# Altium schematic sheet DWM1000Breakout.SchDoc: DecaWave DWM1000
size A4; CompanyName: SPAN; Engineer: Anh Luong; Organization: University of Utah; Address1: 50 S Central Campus Dr; Address2: MEB Rm 3129; Address3: Salt Lake City, Utah 84115; Address4: USA; Revision: 1; SheetNumber: 1; SheetTotal: 1
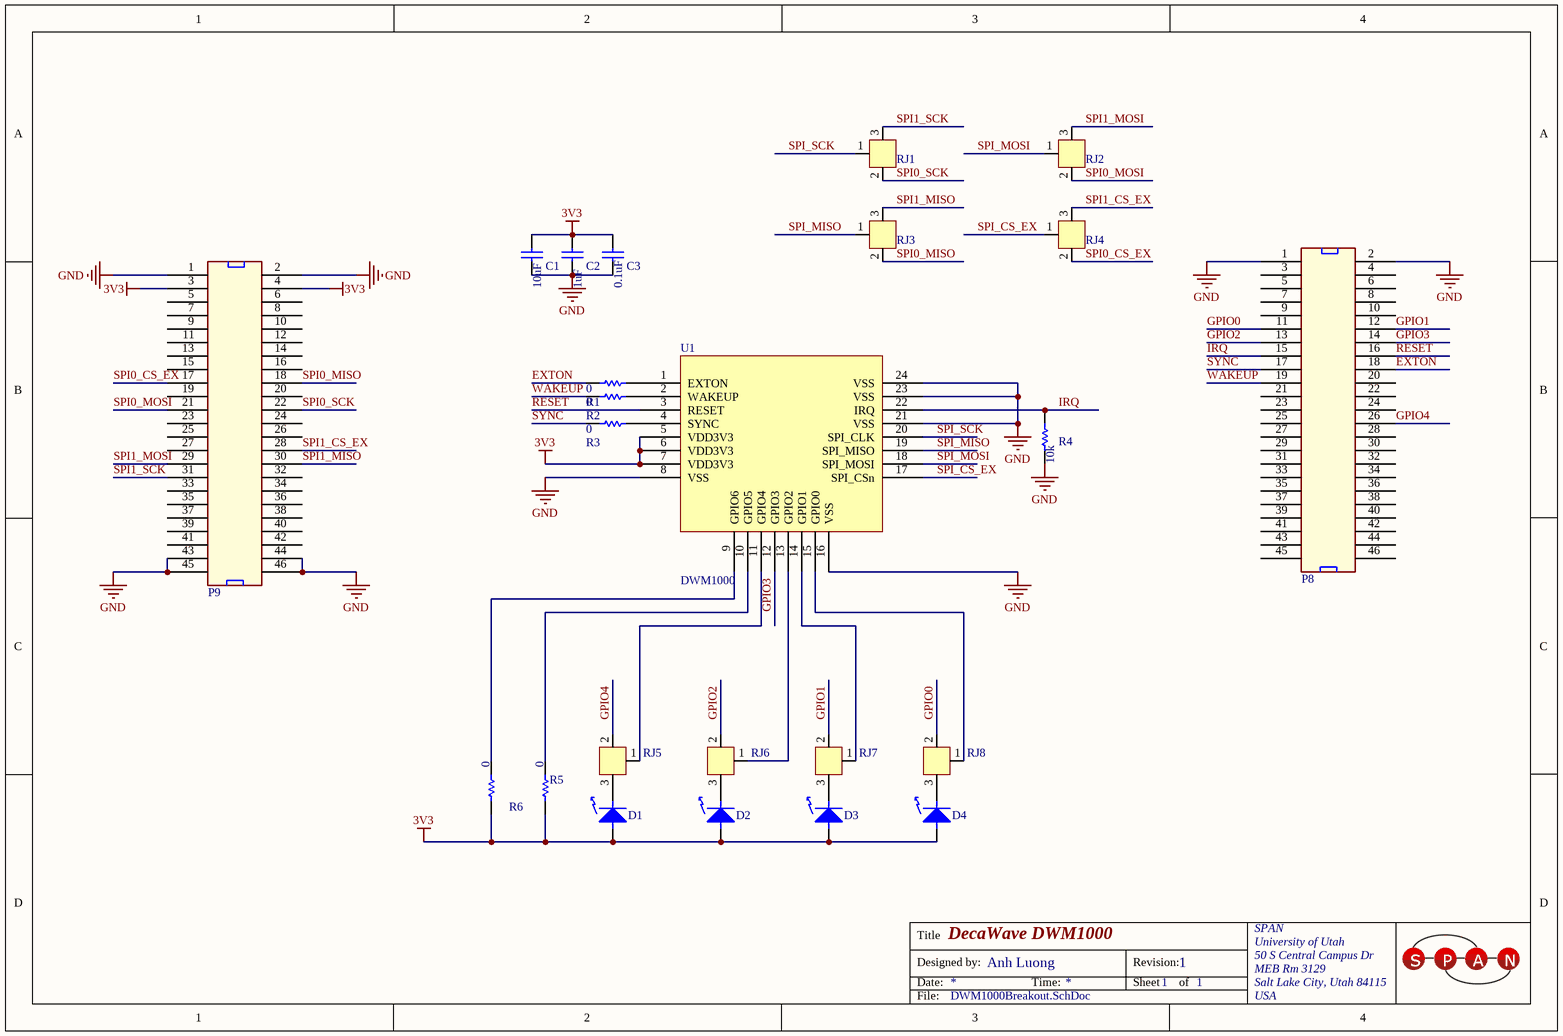
[diagram p0: DWM1000Breakout.SchDoc]

## Parts
C1  GRM188R60J106ME47D  [CAPC1608X08N (0603)]  (value not drawn)
C2  GRM188R61A105KA61D  [CAPC1608X08N (0603)]  (value not drawn)
C3  GRM188R71C104KA01D  [CAPC1608X08N (0603)]  (value not drawn)
D1  LG Q971-KN-1  [CHIPLED0603]  (value not drawn)
D2  LG Q971-KN-1  [CHIPLED0603]  (value not drawn)
D3  LG Q971-KN-1  [CHIPLED0603]  (value not drawn)
D4  LG Q971-KN-1  [CHIPLED0603]  (value not drawn)
P8  PREC023DAAN-RC  [HEADER23X2]  (value not drawn)
P9  PREC023DAAN-RC  [HEADER23X2]  (value not drawn)
R1  MCR03ERTJ000  [RESC1608X06N (0603)]  (value not drawn)
R2  MCR03ERTJ000  [RESC1608X06N (0603)]  (value not drawn)
R3  MCR03ERTJ000  [RESC1608X06N (0603)]  (value not drawn)
R4  MCR03ERTJ103  [RESC1608X06N (0603)]  (value not drawn)
R5  MCR03ERTJ000  [RESC1608X06N (0603)]  (value not drawn)
R6  MCR03ERTJ000  [RESC1608X06N (0603)]  (value not drawn)
RJ1  R_J  [RJ]  (value not drawn)
RJ2  R_J  [RJ]  (value not drawn)
RJ3  R_J  [RJ]  (value not drawn)
RJ4  R_J  [RJ]  (value not drawn)
RJ5  R_J  [RJ]  (value not drawn)
RJ6  R_J  [RJ]  (value not drawn)
RJ7  R_J  [RJ]  (value not drawn)
RJ8  R_J  [RJ]  (value not drawn)
U1  DWM1000  [DWM1000]

## Nets
3V3: C1.2 C2.2 C3.2 D1.1 D2.1 D3.1 D4.1 P9.3 P9.4 R5.2 R6.2 U1.5(VDD3V3) U1.6(VDD3V3) U1.7(VDD3V3)
GND: C1.1 C2.1 C3.1 P8.1 P8.2 P9.1 P9.2 P9.43 P9.44 P9.45 P9.46 R4.1 U1.8(VSS) U1.16(VSS) U1.21(VSS) U1.23(VSS) U1.24(VSS)
EXTON: P8.18 R1.1
GPIO0: P8.11 RJ8.2
GPIO1: P8.12 RJ7.2
GPIO2: P8.13 RJ6.2
GPIO3: P8.14 U1.12(GPIO3)
GPIO4: P8.26 RJ5.2
IRQ: P8.15 R4.2 U1.22(IRQ)
RESET: P8.16 U1.3(RESET)
SPI0_CS_EX: P9.17 RJ4.2
SPI0_MISO: P9.18 RJ3.2
SPI0_MOSI: P9.21 RJ2.2
SPI0_SCK: P9.22 RJ1.2
SPI1_CS_EX: P9.28 RJ4.3
SPI1_MISO: P9.30 RJ3.3
SPI1_MOSI: P9.29 RJ2.3
SPI1_SCK: P9.31 RJ1.3
SPI_CS_EX: RJ4.1 U1.17(SPI_CSn)
SPI_MISO: RJ3.1 U1.19(SPI_MISO)
SPI_MOSI: RJ2.1 U1.18(SPI_MOSI)
SPI_SCK: RJ1.1 U1.20(SPI_CLK)
SYNC: P8.17 R3.1
WAKEUP: P8.19 R2.1
NetD1_2: D1.2 RJ5.3
NetD2_2: D2.2 RJ6.3
NetD3_2: D3.2 RJ7.3
NetD4_2: D4.2 RJ8.3
NetR1_2: R1.2 U1.1(EXTON)
NetR2_2: R2.2 U1.2(WAKEUP)
NetR3_2: R3.2 U1.4(SYNC)
NetR5_1: R5.1 U1.10(GPIO5)
NetR6_1: R6.1 U1.9(GPIO6)
NetRJ5_1: RJ5.1 U1.11(GPIO4)
NetRJ6_1: RJ6.1 U1.13(GPIO2)
NetRJ7_1: RJ7.1 U1.14(GPIO1)
NetRJ8_1: RJ8.1 U1.15(GPIO0)

Not connected (* = marked no-connect by the designer): P8 3(2) 4(27) 5(3) 6(28) 7(4) 8(29) 9(5) 10(30) 20(35) 21(11) 22(36) 23(12) 24(37) 25(13) 27(14) 28(39) 29(15) 30(40) 31(16) 32(41) 33(17) 34(42) 35(18) 36(43) 37(19) 38(44) 39(20) 40(45) 41(21) 42(46) 43(22) 44(47) 45(23) 46(48); P9 5(3) 6(28) 7(4) 8(29) 9(5) 10(30) 11(6) 12(31) 13(7) 14(32) 15(8) 16(33) 19(10) 20(35) 23(12) 24(37) 25(13) 26(38) 27(14) 32(41) 33(17) 34(42) 35(18) 36(43) 37(19) 38(44) 39(20) 40(45) 41(21) 42(46)

## Notes on the sheet
- Title
- Designed by:
- Date:
- Time:
- Revision:
- Sheet
- of
- File:
- (in symbol GRM188R60J106ME47D) 10uF
- (in symbol GRM188R61A105KA61D) 1uF
- (in symbol GRM188R71C104KA01D) 0.1uF
- (in symbol MCR03ERTJ000) 0

## Library data of the parts
C1 = GRM188R60J106ME47D: CAP CER 10UF 6.3V 20% X5R 0603; Manufacturer: Murata Electronics North America; Capacitance: 10µF; Supplier 1: Digi-Key; Manufacturer Part Number: GRM188R60J106ME47D; RoHS: RoHS Compliant; Category: Capacitors; Stock 1: 2128324; Pricing 1: 1=0.24, 10=0.2, 50=0.1126, 100=0.1, 250=0.075, 500=0.06626, 1000=0.05875 (USD); Packaging: Digi-Reel®; Voltage - Rated: 6.3V; Tolerance: ±20%; Temperature Coefficient: X5R; Mounting Type: Surface Mount, MLCC; Operating Temperature: -55°C ~ 85°C; Applications: General Purpose; Ratings: -; Package / Case: 0603 (1608 Metric); Size / Dimension: 0.063" L x 0.031" W (1.60mm x 0.80mm); Height - Seated (Max): -; Thickness (Max): 0.035" (0.90mm); Lead Spacing: -; Features: -; Lead Style: -; ComponentLink1URL: http://search.murata.co.jp/Ceramy/image/img/A01X/G101/ENG/GRM188R60J106ME47-01.pdf; ComponentLink1Description: http://search.murata.co.jp/Ceramy/image/img/A01X/G101/ENG/GRM188R60J106ME47-01.pdf; Supplier 2: Digi-Key
C2 = GRM188R61A105KA61D: CAP CER 1UF 10V 10% X5R 0603; Manufacturer: Murata Electronics North America; Capacitance: 1.0µF; Supplier 1: Digi-Key; Manufacturer Part Number: GRM188R61A105KA61D; RoHS: RoHS Compliant; Category: Capacitors; Stock 1: 244919; Pricing 1: 1=0.1, 10=0.041, 50=0.0224, 100=0.019, 250=0.01552, 500=0.01328, 1000=0.01035 (USD); Packaging: Cut Tape (CT); Voltage - Rated: 10V; Tolerance: ±10%; Temperature Coefficient: X5R; Mounting Type: Surface Mount, MLCC; Operating Temperature: -55°C ~ 85°C; Applications: General Purpose; Ratings: -; Package / Case: 0603 (1608 Metric); Size / Dimension: 0.063" L x 0.031" W (1.60mm x 0.80mm); Height - Seated (Max): -; Thickness (Max): 0.035" (0.90mm); Lead Spacing: -; Features: -; Lead Style: -; ComponentLink1URL: http://search.murata.co.jp/Ceramy/image/img/A01X/G101/ENG/GRM188R61A105KA61-01.pdf; ComponentLink1Description: http://search.murata.co.jp/Ceramy/image/img/A01X/G101/ENG/GRM188R61A105KA61-01.pdf
C3 = GRM188R71C104KA01D: CAP CER 0.1UF 16V 10% X7R 0603; Manufacturer: Murata Electronics North America; Capacitance: 0.1µF; Supplier 1: Digi-Key; Manufacturer Part Number: GRM188R71C104KA01D; RoHS: RoHS Compliant; Category: Capacitors; Stock 1: 1458181; Pricing 1: 1=0.1, 10=0.019, 50=0.0102, 100=0.0086, 250=0.00704, 500=0.006, 1000=0.00468 (USD); Packaging: Cut Tape (CT); Tolerance: ±10%; Voltage - Rated: 16V; Temperature Coefficient: X7R; Mounting Type: Surface Mount, MLCC; Operating Temperature: -55°C ~ 125°C; Applications: General Purpose; Ratings: -; Package / Case: 0603 (1608 Metric); Size / Dimension: 0.063" L x 0.031" W (1.60mm x 0.80mm); Height - Seated (Max): -; Thickness (Max): 0.035" (0.90mm); Lead Spacing: -; Features: -; Lead Style: -; ComponentLink1URL: http://search.murata.co.jp/Ceramy/image/img/A01X/G101/ENG/GRM188R71C104KA01-01.pdf; ComponentLink1Description: http://search.murata.co.jp/Ceramy/image/img/A01X/G101/ENG/GRM188R71C104KA01-01.pdf
D1-D4 = LG Q971-KN-1: LED CHIPLED 570NM GREEN 0603 SMD; Manufacturer: OSRAM Opto Semiconductors Inc; Wavelength - Peak: 572nm; Millicandela Rating: 10mcd; Voltage - Forward (Vf) Typ: 2.2V; Current - Test: 20mA; Viewing Angle: 160°; Lens Type: Diffused; Lens Style/Size: Rectangle with Flat Top, 1mm x 0.8mm; Supplier 1: Digi-Key; Manufacturer Part Number: LG Q971-KN-1; RoHS: RoHS Compliant; Category: Optoelectronics; Stock 1: 44000; Pricing 1: 4000=0.03632 (USD); Packaging: Tape & Reel (TR); Color: Green; Wavelength - Dominant: 570nm; Package / Case: 0603 (1608 Metric); Size / Dimension: 1.60mm L x 0.80mm W; Height: 0.80mm; Mounting Type: Surface Mount; Luminous Flux @ Current - Test: -; ComponentLink1URL: http://catalog.osram-os.com/catalogue/catalogue.do;jsessionid=DE4D071D0D2758CC117C711BF848053E?act=downloadFile&favOid=0200000600005069000100b6; ComponentLink1Description: http://catalog.osram-os.com/catalogue/catalogue.do;jsessionid=DE4D071D0D2758CC117C711BF848053E?act=downloadFile&favOid=0200000600005069000100b6
P8 P9 = PREC023DAAN-RC: CONN HEADER .100" DUAL STR 46POS; Manufacturer: Sullins Connector Solutions; Connector Type: Header, Unshrouded; Number of Positions: 46; Number of Positions Loaded: All; Pitch: 0.100" (2.54mm); Supplier 1: Digi-Key; Manufacturer Part Number: PREC023DAAN-RC; RoHS: RoHS Compliant; Category: Connectors, Interconnects; Stock 1: 0; Pricing 1: 1=0.79, 10=0.706, 100=0.5813, 500=0.45952, 1000=0.39447, 5000=0.35987, 10000=0.34603 (USD); Packaging: Bulk; Contact Type: Male Pin; Number of Rows: 2; Row Spacing: 0.100" (2.54mm); Contact Mating Length: 0.230" (5.84mm); Mounting Type: Through Hole; Termination: Solder; Fastening Type: -; Features: -; Contact Finish: Tin; Contact Finish Thickness: -; Color: Black; ComponentLink1URL: http://media.digikey.com/PDF/Data%20Sheets/Sullins%20PDFs/xRxCzzzDxxN-RC_11636-B.pdf; ComponentLink1Description: http://media.digikey.com/PDF/Data%20Sheets/Sullins%20PDFs/xRxCzzzDxxN-RC_11636-B.pdf
R1-R3 R5 R6 = MCR03ERTJ000: RES 0.0 OHM 1/10W JUMP 0603 SMD; Manufacturer: Rohm Semiconductor; Resistance (Ohms): 0.0; Tolerance: Jumper; Power (Watts): 0.1W, 1/10W; Supplier 1: Digi-Key; Manufacturer Part Number: MCR03ERTJ000; RoHS: RoHS Compliant; Category: Resistors; Stock 1: 127296; Pricing 1: 1=0.1, 25=0.0064, 100=0.0035, 250=0.00268, 500=0.00214, 1000=0.00157 (USD); Packaging: Cut Tape (CT); Composition: Thick Film; Features: -; Temperature Coefficient: -; Package / Case: 0603 (1608 Metric); Supplier Device Package: 0603 (1608 Metric); Size / Dimension: 0.063" L x 0.031" W (1.60mm x 0.80mm); Height: 0.022" (0.55mm); Number of Terminations: 2; ComponentLink1URL: http://rohmfs.rohm.com/en/products/databook/datasheet/passive/resistor/chip_resistor/mcr_g.pdf; ComponentLink1Description: http://rohmfs.rohm.com/en/products/databook/datasheet/passive/resistor/chip_resistor/mcr_g.pdf
R4 = MCR03ERTJ103: RES 10K OHM 1/10W 5% 0603 SMD; Manufacturer: Rohm Semiconductor; Power (Watts): 0.1W, 1/10W; Temperature Coefficient: ±200ppm/°C; Supplier 1: Digi-Key; Manufacturer Part Number: MCR03ERTJ103; RoHS: RoHS Compliant; Category: Resistors; Stock 1: 330000; Pricing 1: 5000=0.00103, 10000=0.00089, 25000=0.00078, 50000=0.00072, 125000=0.0007 (USD); Packaging: Tape & Reel (TR); Resistance (Ohms): 10k; Tolerance: ±5%; Composition: Thick Film; Features: -; Package / Case: 0603 (1608 Metric); Supplier Device Package: 0603 (1608 Metric); Size / Dimension: 0.063" L x 0.031" W (1.60mm x 0.80mm); Height: 0.022" (0.55mm); Number of Terminations: 2; ComponentLink1URL: http://rohmfs.rohm.com/en/products/databook/datasheet/passive/resistor/chip_resistor/mcr_g.pdf; ComponentLink1Description: http://rohmfs.rohm.com/en/products/databook/datasheet/passive/resistor/chip_resistor/mcr_g.pdf
RJ1-RJ8 = R_J: Resistor Jumper; Value: DNP; Mounting Type: Surface Mount, MLCC; Applications: General Purpose; Package / Case: 0603 (1608 Metric)
U1 = DWM1000: MOD IEEE802.15.4-2011 UWB TXRX; Manufacturer: Decawave Limited; Frequency: 3.5GHz ~ 6.5GHz; Data Rate: 6.8Mbps; Serial Interfaces: SPI; Antenna Type: Integrated, Chip; Voltage - Supply: 2.8 V ~ 3.6 V; Current - Receiving: 64mA; Current - Transmitting: 31mA; Supplier 1: Digi-Key; Manufacturer Part Number: DWM1000; RoHS: RoHS Compliant; Category: RF/IF and RFID; Stock 1: 1028; Pricing 1: 1=32.16, 10=26.704, 100=24.24, 250=22.51296 (USD); Packaging: Cut Tape (CT); RF Family/Standard: 802.15.4; Protocol: -; Modulation: -; Power - Output: -; Sensitivity: -; Memory Size: -; Mounting Type: Surface Mount; Operating Temperature: -40°C ~ 85°C; Package / Case: Module; ComponentLink1URL: http://www.decawave.com/sites/default/files/product-pdf/dwm1000-product-brief.pdf; ComponentLink1Description: http://www.decawave.com/sites/default/files/product-pdf/dwm1000-product-brief.pdf; Supplier Part Number 1: 1479-1002-1-ND